# EAGLE design Bu sefer olacak (EAGLE 8.5.1)
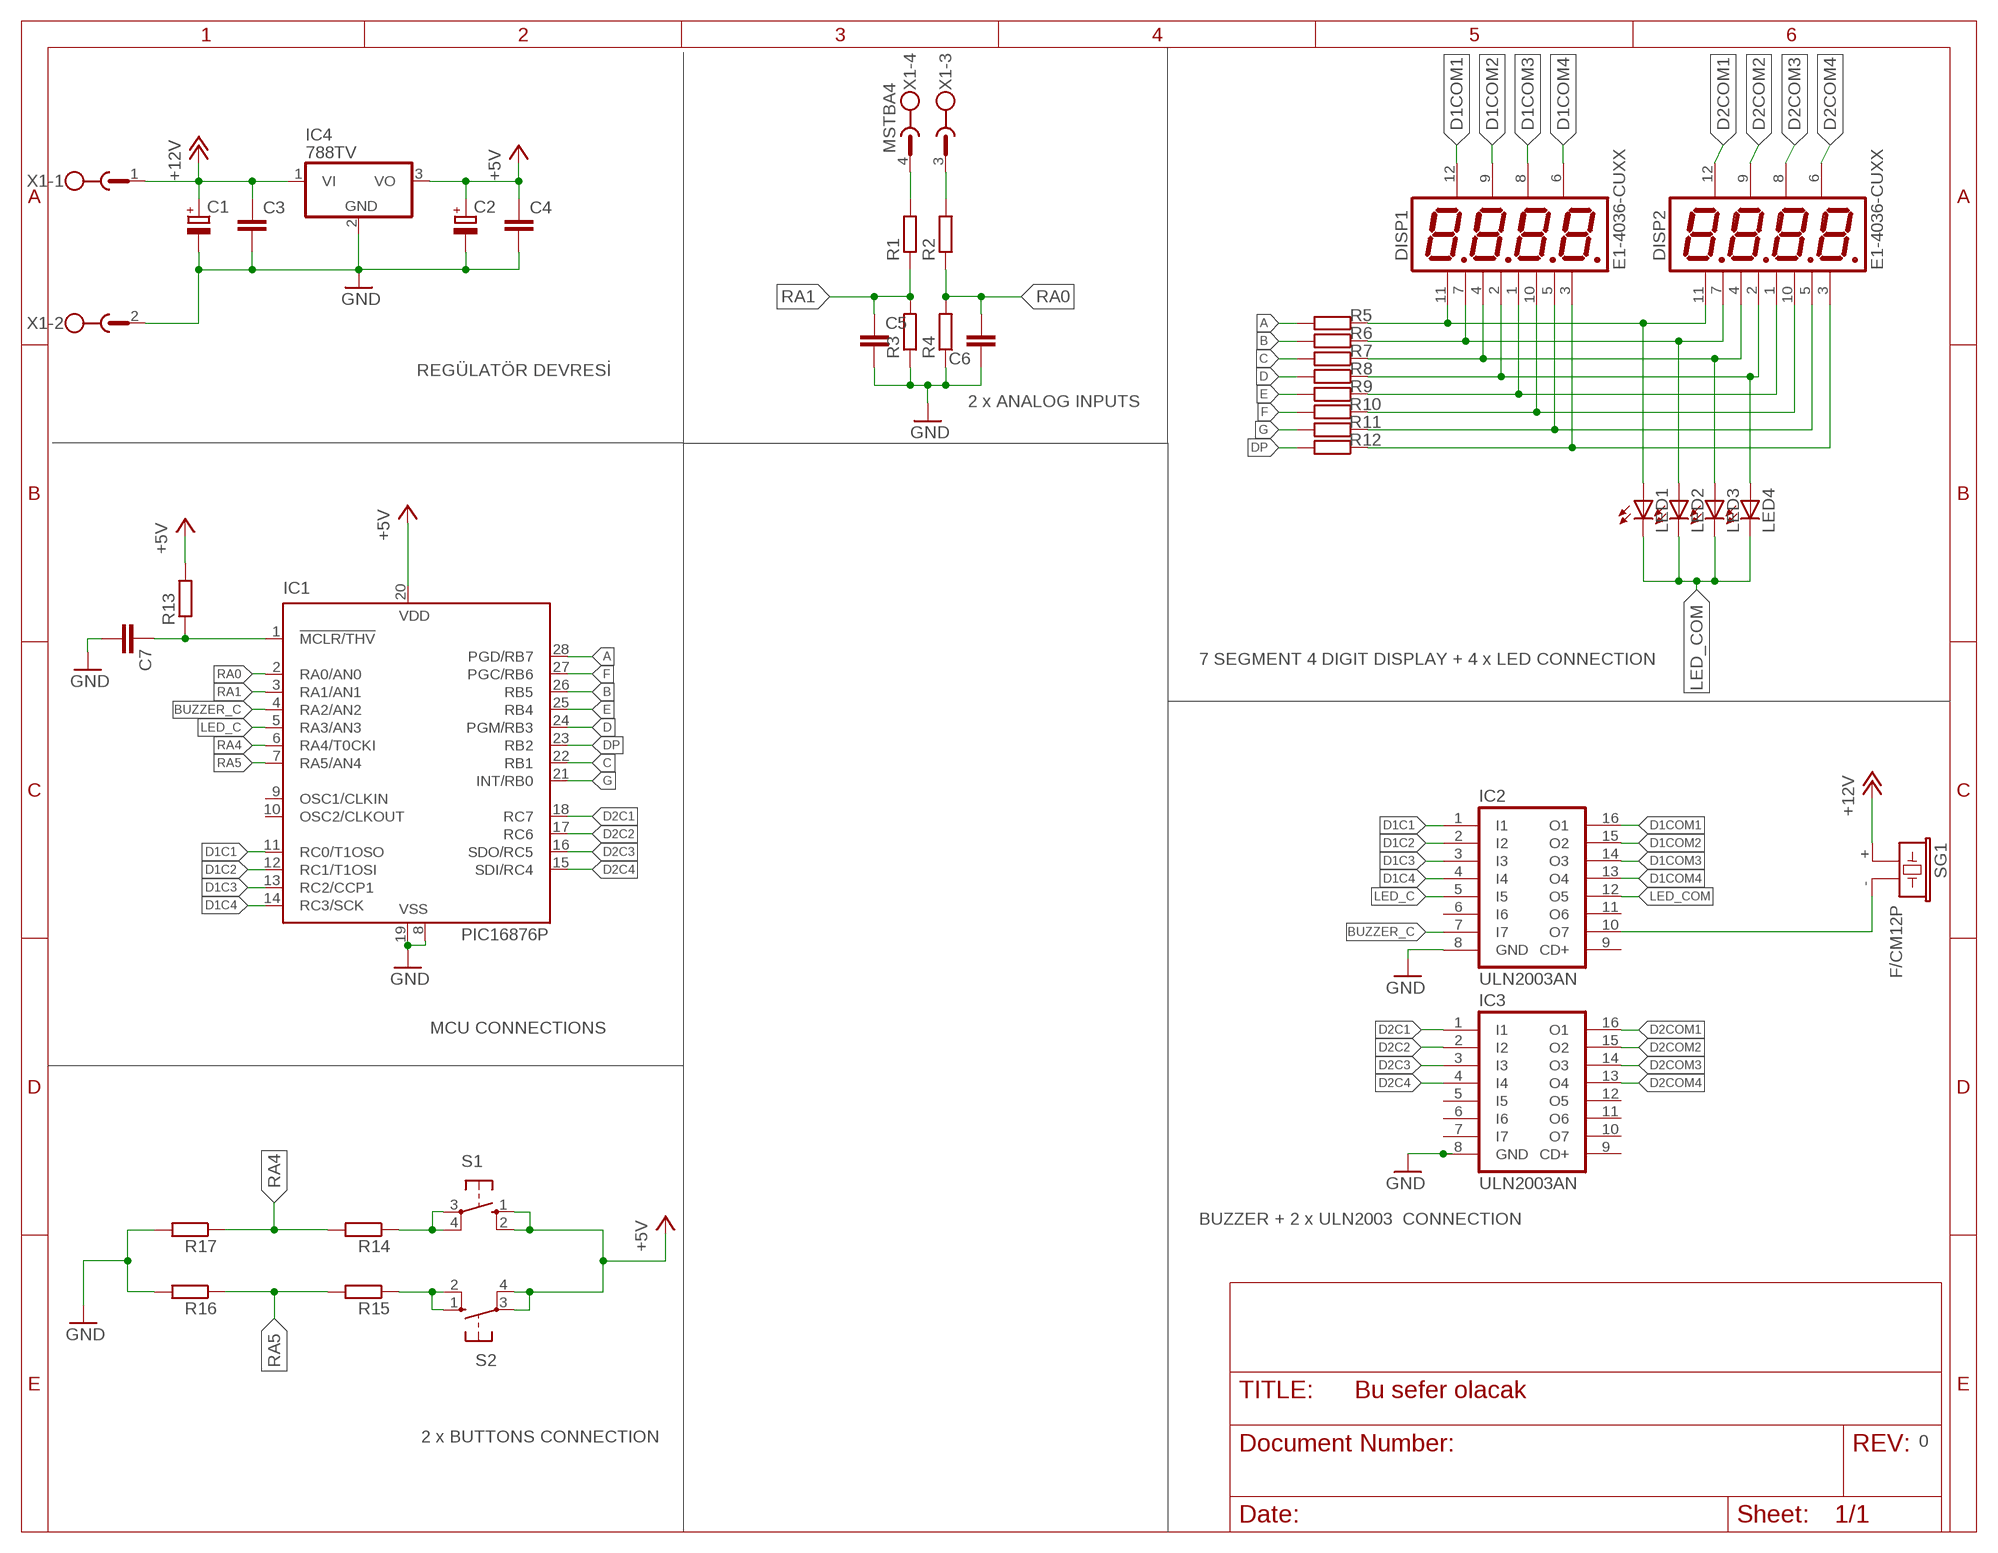
[diagram p0: schematic, sheet 1]

## Parts
C1  CPOL-EUE5-8.5  [E5-8,5]
C2  CPOL-EUE5-8.5  [E5-8,5]
C3  C-EU050-025X075  [C050-025X075]
C4  C-EU050-025X075  [C050-025X075]
C5  C-EU050-025X075  [C050-025X075]
C6  C-EU050-025X075  [C050-025X075]
C7  C-EU050-025X075  [C050-025X075]
DISP1  E1-4036-CUXX  [E1-4036-CUXX]
DISP2  E1-4036-CUXX  [E1-4036-CUXX]
IC1  PIC16876P  [DIL28-3]
IC2  ULN2003AN  [DIL16]
IC3  ULN2003AN  [DIL16]
IC4  788TV  [TO220V]
LED1  LED5MM  [LED5MM]
LED2  LED5MM  [LED5MM]
LED3  LED5MM  [LED5MM]
LED4  LED5MM  [LED5MM]
R1  R-EU_0207/10  [0207/10]
R2  R-EU_0207/10  [0207/10]
R3  R-EU_0207/10  [0207/10]
R4  R-EU_0207/10  [0207/10]
R5  R-EU_0207/10  [0207/10]
R6  R-EU_0207/10  [0207/10]
R7  R-EU_0207/10  [0207/10]
R8  R-EU_0207/10  [0207/10]
R9  R-EU_0207/10  [0207/10]
R10  R-EU_0207/10  [0207/10]
R11  R-EU_0207/10  [0207/10]
R12  R-EU_0207/10  [0207/10]
R13  R-EU_0207/10  [0207/10]
R14  R-EU_0207/10  [0207/10]
R15  R-EU_0207/10  [0207/10]
R16  R-EU_0207/10  [0207/10]
R17  R-EU_0207/10  [0207/10]
S1  10-XX  [B3F-10XX]
S2  10-XX  [B3F-10XX]
SG1  F/CM12P  [F/CM12P]
X1  MSTBA4  [MSTBA4]

## Nets
+5V: C2.+ C4.1 IC1.20(VDD) IC4.3(VO) R13.2 S1.1(S) S1.2(S1) S2.3(P) S2.4(P1)
+12V: C1.+ C3.1 IC4.1(VI) SG1.+ X1.1
A: IC1.28(PGD/RB7) R5.2
B: IC1.26(RB5) R6.2
BUZZER_C: IC1.4(RA2/AN2) IC2.7(I7)
C: IC1.22(RB1) R7.2
D: IC1.24(PGM/RB3) R8.2
D1C1: IC1.11(RC0/T1OSO) IC2.1(I1)
D1C2: IC1.12(RC1/T1OSI) IC2.2(I2)
D1C3: IC1.13(RC2/CCP1) IC2.3(I3)
D1C4: IC1.14(RC3/SCK) IC2.4(I4)
D1COM1: DISP1.12(DIG1) IC2.16(O1)
D1COM2: DISP1.9(DIG2) IC2.15(O2)
D1COM3: DISP1.8(DIG3) IC2.14(O3)
D1COM4: DISP1.6(DIG4) IC2.13(O4)
D2C1: IC1.18(RC7) IC3.1(I1)
D2C2: IC1.17(RC6) IC3.2(I2)
D2C3: IC1.16(SDO/RC5) IC3.3(I3)
D2C4: IC1.15(SDI/RC4) IC3.4(I4)
D2COM1: DISP2.12(DIG1) IC3.16(O1)
D2COM2: DISP2.9(DIG2) IC3.15(O2)
D2COM3: DISP2.8(DIG3) IC3.14(O3)
D2COM4: DISP2.6(DIG4) IC3.13(O4)
DP: IC1.23(RB2) R12.2
E: IC1.25(RB4) R9.2
F: IC1.27(PGC/RB6) R10.2
G: IC1.21(INT/RB0) R11.2
GND: C1.- C2.- C3.2 C4.2 C5.2 C6.1 C7.2 IC1.8(VSS) IC1.19(VSS) IC2.8(GND) IC3.8(GND) IC4.2(GND) R3.1 R4.1 R16.2 R17.2 X1.2
LED_C: IC1.5(RA3/AN3) IC2.5(I5)
LED_COM: IC2.12(O5) LED1.K(C) LED2.K(C) LED3.K(C) LED4.K(C)
N$1: DISP1.11(A) DISP2.11(A) LED1.A R5.1
N$2: DISP1.7(B) DISP2.7(B) LED2.A R6.1
N$3: DISP1.4(C) DISP2.4(C) LED3.A R7.1
N$4: DISP1.2(D) DISP2.2(D) LED4.A R8.1
N$5: DISP1.1(E) DISP2.1(E) R9.1
N$6: R1.2 X1.4
N$7: R2.2 X1.3
N$8: DISP1.10(F) DISP2.10(F) R10.1
N$9: DISP1.5(G) DISP2.5(G) R11.1
N$10: DISP1.3(DP) DISP2.3(DP) R12.1
N$11: C7.1 IC1.1(!MCLR/THV) R13.1
N$15: R14.1 S1.3(P) S1.4(P1)
N$16: R15.1 S2.1(S) S2.2(S1)
N$25: IC2.10(O7) SG1.-
RA0: C6.2 IC1.2(RA0/AN0) R2.1 R4.2
RA1: C5.1 IC1.3(RA1/AN1) R1.1 R3.2
RA4: IC1.6(RA4/T0CKI) R14.2 R17.1
RA5: IC1.7(RA5/AN4) R15.2 R16.1
Unconnected: IC1.9(OSC1/CLKIN) IC1.10(OSC2/CLKOUT) IC2.6(I6) IC2.9(CD+) IC2.11(O6) IC3.5(I5) IC3.6(I6) IC3.7(I7) IC3.9(CD+) IC3.10(O7) IC3.11(O6) IC3.12(O5)

## Notes on the sheet
- REGÜLATÖR DEVRESİ
- 2 x ANALOG INPUTS
- 7 SEGMENT 4 DIGIT DISPLAY + 4 x LED CONNECTION
- MCU CONNECTIONS
- BUZZER + 2 x ULN2003  CONNECTION
- 2 x BUTTONS CONNECTION | 0

## Library data of the parts
C1 C2 = rcl:CPOL-EU: POLARIZED CAPACITOR, European symbol
C3-C7 = rcl:C-EU: CAPACITOR, European symbol
DISP1 DISP2 = special:E1-4036-CUXX
IC1 = microchip:PIC16*876: MICROCONTROLLER flash type; OC_FARNELL: unknown; OC_NEWARK: unknown
IC2 IC3 = uln-udn:ULN2003A: DRIVER ARRAY
IC4 = linear:78*: Positive VOLTAGE REGULATOR Source: http://cache.national.com/ds/LM/LM78L05.pdf http://www.fairchildsemi.com/ds/LM/LM7805.pdf
LED1-LED4 = led:LED: LED OSRAM: - CHIPLED LG R971, LG N971, LY N971, LG Q971, LY Q971, LO R971, LY R971 LH N974, LH R974 LS Q976, LO Q976, LY Q976 LO Q996 - Hyper CHIPLED LW Q18S LB Q993, LB Q99A, LB R99A - SideLED LS A670, LO A670, LY A670, LG A670, LP A670 LB A673, LV A673, LT A673, LW A673 LH A674 LY A675 LS A676, LA A676, LO A676, LY A676, LW A676 LS A679, LY A679, LG A679 - Hyper Micro SIDELED® LS Y876, LA Y876, LO Y876, LY Y876 LT Y87S - SmartLED LW L88C, LW L88S LB L89C, LB L89S, LG L890 LS L89K, LO L89K, LY L89K LS L896, LA L896, LO L896, LY L896 - TOPLED LS T670, LO T670, LY T670, LG T670, LP T670 LSG T670, LSP T670, LSY T670, LOP T670, LYG T670 LG T671, LOG T671, LSG T671 LB T673, LV T673, LT T673, LW T673 LH T674 LS T676, LA T676, LO T676, LY T676, LB T676, LH T676, LSB T676, LW T676 LB T67C, LV T67C, LT T67C, LS T67K, LO T67K, LY T67K, LW E67C LS E67B, LA E67B, LO E67B, LY E67B, LB E67C, LV E67C, LT E67C LW T67C LS T679, LY T679, LG T679 LS T770, LO T770, LY T770, LG T770, LP T770 LB T773, LV T773, LT T773, LW T773 LH T774 LS E675, LA E675, LY E675, LS T675 LS T776, LA T776, LO T776, LY T776, LB T776 LHGB T686 LT T68C, LB T68C - Hyper Mini TOPLED® LB M676 - Mini TOPLED Santana® LG M470 LS M47K, LO M47K, LY M47K Source: http://www.osram.convergy.de LUXEON: - LUMILED® LXK2-PW12-R00, LXK2-PW12-S00, LXK2-PW14-U00, LXK2-PW14-V00 LXK2-PM12-R00, LXK2-PM12-S00, LXK2-PM14-U00 LXK2-PE12-Q00, LXK2-PE12-R00, LXK2-PE12-S00, LXK2-PE14-T00, LXK2-PE14-U00 LXK2-PB12-K00, LXK2-PB12-L00, LXK2-PB12-M00, LXK2-PB14-N00, LXK2-PB14-P00, LXK2-PB14-Q00 LXK2-PR12-L00, LXK2-PR12-M00, LXK2-PR14-Q00, LXK2-PR14-R00 LXK2-PD12-Q00, LXK2-PD12-R00, LXK2-PD12-S00 LXK2-PH12-R00, LXK2-PH12-S00 LXK2-PL12-P00, LXK2-PL12-Q00, LXK2-PL12-R00 Source: www.luxeon.com KINGBRIGHT: KA-3528ASYC Source: www.kingbright.com
R1-R17 = rcl:R-EU_: RESISTOR, European symbol
S1 S2 = switch-omron:10-XX: OMRON SWITCH; MPN: B3F-1000; OC_FARNELL: 176432; OC_NEWARK: 36M3542
SG1 = buzzer:F/CM12P: BUZZER Source: Buerklin; OC_FARNELL: unknown; OC_NEWARK: unknown
X1 = con-phoenix-508:MSTBA4: PHOENIX; MF: FARNELL; MPN: 1757268; OC_FARNELL: 3705195; OC_NEWARK: 71C4163

## Board
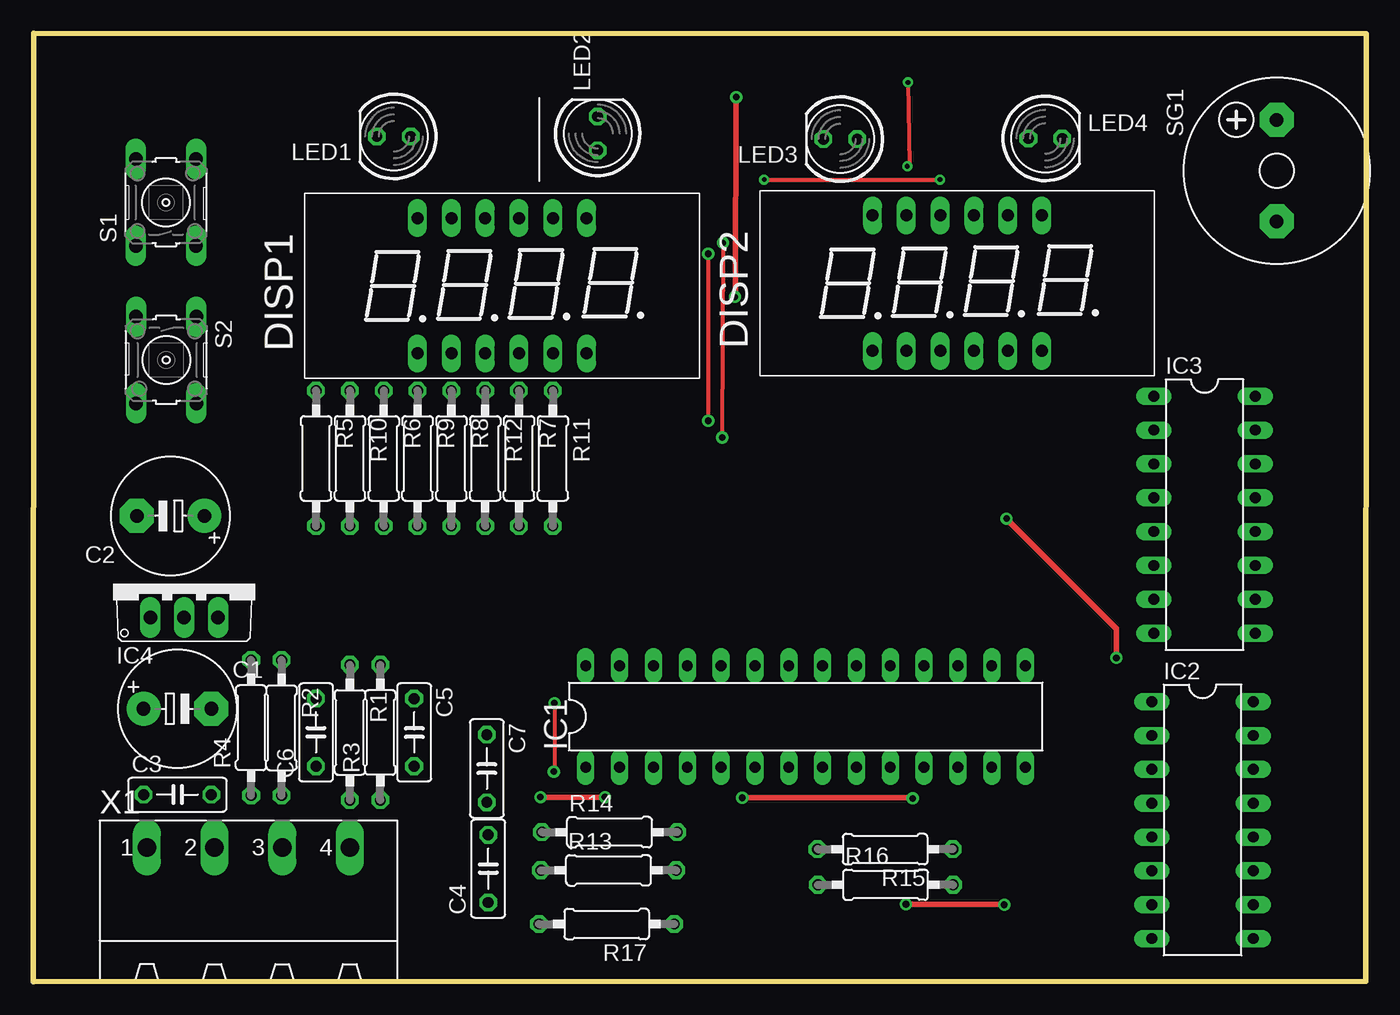
[diagram p1: board, top side]
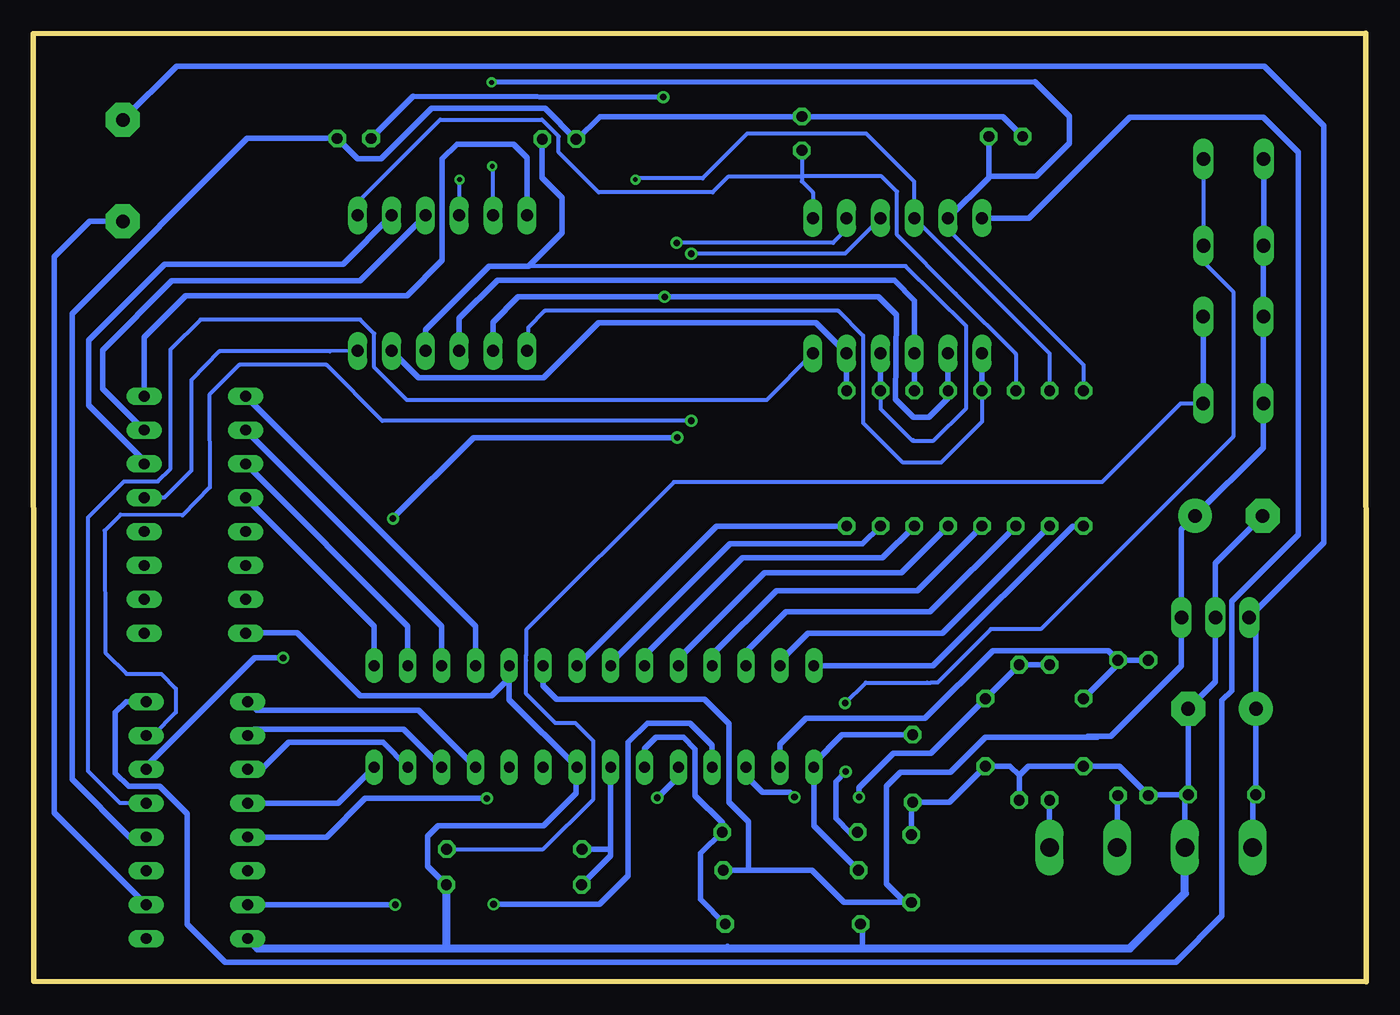
[diagram p2: board, bottom side, seen from below]

Size 100.1 x 71.2 mm. Coordinates in mm from the lower left corner, seen from the top.
Outline: 0,0 0.02,71.2 100.1,71.15 100.07,0.05 0,0
Copper layers (1*16): Top 0.035mm / dielectric 1.5mm / Bottom 0.035mm
Design rules "default": minimum track width 10mil, minimum drill 24mil, track to track 8mil, track to pad 8mil, pad to pad 8mil, via to via 8mil, smd to smd 8mil, copper to edge 40mil, drill to drill 8mil, minimum pad ring 10mil, minimum via ring 8mil, stop-mask expansion 4mil, vias tented up to drill 0mil, thermal gap 10mil

### Footprints (pad centres in the part's own frame; a part is rotated, then mirrored left to right if it is on the bottom)
E5-8,5 = drill 1.016 pad 2.54: + -2.54,0 | drill 1.016 pad 2.54 octagon: - 2.54,0
C050-025X075 = drill 0.813 octagon: 1 -2.54,0; 2 2.54,0
E1-4036-CUXX = drill 0.9 pad 1.422 long: 1 -6.35,-5.08; 2 -3.81,-5.08; 3 -1.27,-5.08; 4 1.27,-5.08; 5 3.81,-5.08; 6 6.35,-5.08; 7 6.35,5.08; 8 3.81,5.08; 9 1.27,5.08; 10 -1.27,5.08; 11 -3.81,5.08; 12 -6.35,5.08
DIL28-3 = drill 0.813 long: 1 -16.51,-3.81; 2 -13.97,-3.81; 3 -11.43,-3.81; 4 -8.89,-3.81; 5 -6.35,-3.81; 6 -3.81,-3.81; 7 -1.27,-3.81; 8 1.27,-3.81; 9 3.81,-3.81; 10 6.35,-3.81; 11 8.89,-3.81; 12 11.43,-3.81; 13 13.97,-3.81; 14 16.51,-3.81; 15 16.51,3.81; 16 13.97,3.81; 17 11.43,3.81; 18 8.89,3.81; 19 6.35,3.81; 20 3.81,3.81; 21 1.27,3.81; 22 -1.27,3.81; 23 -3.81,3.81; 24 -6.35,3.81; 25 -8.89,3.81; 26 -11.43,3.81; 27 -13.97,3.81; 28 -16.51,3.81
DIL16 = drill 0.813 long: 1 -8.89,-3.81; 2 -6.35,-3.81; 3 -3.81,-3.81; 4 -1.27,-3.81; 5 1.27,-3.81; 6 3.81,-3.81; 7 6.35,-3.81; 8 8.89,-3.81; 9 8.89,3.81; 10 6.35,3.81; 11 3.81,3.81; 12 1.27,3.81; 13 -1.27,3.81; 14 -3.81,3.81; 15 -6.35,3.81; 16 -8.89,3.81
TO220V = drill 1.016 long: 1 -2.54,-2.54; 2 0,-2.54; 3 2.54,-2.54
LED5MM = drill 0.813 octagon: A -1.27,0; K 1.27,0
0207/10 = drill 0.813 octagon: 1 -5.08,0; 2 5.08,0
B3F-10XX = drill 1.016 long: 1 -3.251,2.261; 2 3.251,2.261; 3 -3.251,-2.261; 4 3.251,-2.261
F/CM12P = drill 1.016 pad 2.54 octagon: + 3.81,0; - -3.81,0
MSTBA4 = drill 1.397 long: 1 -7.62,5.08; 2 -2.54,5.08; 3 2.54,5.08; 4 7.62,5.08

### Placement (x,y rotation side)
C1  10.82,20.49 0 top
C2  10.31,34.97 180 top
C3  10.83,14.04 0 top
C4  34.16,8.48 90 top
C5  28.6,18.71 270 top
C6  21.23,18.71 90 top
C7  34.06,16 270 top
DISP1  35.2,52.24 0 top
DISP2  69.38,52.44 0 top
IC1  58,19.91 0 top
IC2  87.81,12.13 270 top
IC3  87.96,35.06 270 top
IC4  11.33,29.89 0 top
LED1  27.08,63.45 180 top
LED2  42.38,63.68 90 top
LED3  60.61,63.25 180 top
LED4  76,63.3 0 top
R1  23.78,18.71 270 top
R2  18.64,19.06 270 top
R3  26.06,18.71 90 top
R4  16.36,19.06 90 top
R5  21.23,39.29 270 top
R6  26.32,39.29 270 top
R7  36.48,39.29 270 top
R8  31.4,39.29 270 top
R9  28.86,39.29 270 top
R10  23.78,39.29 270 top
R11  39.02,39.29 270 top
R12  33.94,39.29 270 top
R13  43.2,8.36 0 top
R14  43.27,11.22 0 top
R15  63.97,9.95 180 top
R16  64,7.28 0 top
R17  43.06,4.33 180 top
S1  9.96,58.5 90 top
S2  9.99,46.67 270 top
SG1  93.38,60.89 90 top
X1  16.16,5 0 top

### Tracks (layer width: path | path; a pad name or v marks a point on that pad's centre or on a via)
+5V
  Bottom 0.406: S1.2 S1.1 7.73,55.22 S2.3 S2.4 7.73,40.09 C2.+ 13.87,33.95 IC4.3 13.87,23.73 19.19,18.41 20.89,18.41 20.89,18.36 | 20.18,18.36 20.89,18.36 | 20.89,18.36 28.59,18.36 31.24,15.71 34.99,15.71 36.04,14.66 36.04,7.36 34.56,5.88 34.1,5.88 | R13.2 46.39,8.36 | 46.39,8.36 41.64,8.36 39.22,5.95 C4.1 34.1,5.88 | IC1.20 61.81,22.23 60.79,21.21 49.69,21.21 47.84,19.36 47.84,13.46 46.39,12.01 46.39,8.36 | 34.1,5.88 34.02,5.88
+12V
  Bottom 0.406: C3.1 C1.+ 8.28,26.84 IC4.1 3.19,32.95 3.19,64.26 7.64,68.71 89.31,68.71 SG1.+ | C3.1 | X1.1 8.54,14.04 C3.1
A
  Bottom 0.406: R5.2 22.04,34.2 32.52,23.72 IC1.28
B
  Bottom 0.406: R6.2 32.76,27.76 43.59,27.76 46.57,24.77 IC1.26
BUZZER_C  (via drill 0.5)
  Top 0.406: v65.54,5.81 72.89,5.81 v72.92,5.78
  Bottom 0.305: IC1.4 49.11,15.38
  Bottom 0.406: v72.92,5.78 IC2.7 | v65.54,5.81 57.59,5.81 55.44,7.96 55.44,17.96 53.99,19.41 50.79,19.41 49.11,17.73 IC1.4
C
  Bottom 0.406: R7.2 37.82,32.86 47.79,32.86 56.73,23.91 IC1.22
D
  Bottom 0.406: R8.2 34.89,30.71 45.19,30.71 51.65,24.25 IC1.24
D1C1
  Bottom 0.406: IC1.11 71.15,20.36 83.33,20.36 IC2.1
D1C2
  Bottom 0.406: IC1.12 72.29,18.96 83.52,18.96 IC2.2
D1C3
  Bottom 0.406: IC1.13 73.83,17.96 80.94,17.96 83.04,15.86 83.92,15.86 IC2.3
D1C4
  Bottom 0.406: IC1.14 77.21,13.4 IC2.4
D1COM1
  Bottom 0.406: DISP1.12 25.33,57.32 17.74,64.91 7.74,64.91 5.09,62.26 5.09,33.56 10.09,28.56 10.09,21.86 10.84,21.11 10.84,4.96 14.29,1.46 84.54,1.46 85.69,1.46 88.54,4.31 88.54,12.61 90.59,14.66 92.94,14.66 93.94,15.66 93.94,20.21 93.12,21.02 IC2.16
D1COM2  (via drill 0.5)
  Top 0.305: v50.69,54.65 v50.69,42.11
  Bottom 0.305: DISP1.9 39.14,54.65 v50.69,54.65 | IC2.15 91.11,18.48 89.39,20.21 89.39,22.01 90.49,23.11 93.09,23.11 94.69,24.71 94.74,33.86 93.54,35.06 88.89,35.01 86.84,37.11 86.89,44.06 84.64,46.31 78.09,46.31 73.89,42.11 v50.69,42.11
D1COM3  (via drill 0.5)
  Top 0.305: v51.79,55.46 v51.74,40.85
  Top 0.406: v73.09,34.76 81.34,26.51 v81.34,24.31
  Bottom 0.305: DISP1.8 39.02,56.48 40.04,55.46 v51.79,55.46
  Bottom 0.406: v51.74,40.85 67.05,40.85 73.09,34.81 v73.09,34.76 | IC2.14 91.62,16.18 83.49,24.31 v81.34,24.31
D1COM4
  Bottom 0.305: IC2.13 93.58,13.4 95.99,15.81 95.99,34.86 93.29,37.56 90.74,37.56 89.79,38.51 89.79,47.46 87.54,49.71 75.54,49.71 74.49,48.66 74.49,46.11 72.04,43.66 45.05,43.66 DISP1.6
D2C1
  Bottom 0.406: IC1.18 66.89,26.69 IC3.1
D2C2
  Bottom 0.406: IC3.2 69.43,26.69 IC1.17
D2C3
  Bottom 0.406: IC1.16 71.97,26.69 IC3.3
D2C4
  Bottom 0.406: IC3.4 74.51,26.69 IC1.15
D2COM1
  Bottom 0.406: IC3.16 91.77,48.38 88.64,51.51 72.04,51.51 69.39,54.16 69.39,61.76 68.29,62.86 64.04,62.86 63.02,61.85 DISP2.12
D2COM2
  Bottom 0.406: IC3.15 94.89,44.53 94.89,47.41 89.69,52.61 75.56,52.61 DISP2.9
D2COM3
  Bottom 0.406: IC3.14 91.77,39.09 95.94,43.26 95.94,48.16 90.24,53.86 76.84,53.86 DISP2.8
D2COM4
  Bottom 0.305: IC3.13 90.27,36.33 88.24,38.36 88.24,45.16 86.14,47.31 77.83,47.31 DISP2.6
DP
  Bottom 0.406: R12.2 36.33,31.81 46.84,31.81 54.19,24.45 IC1.23
E
  Bottom 0.406: R9.2 33.7,29.36 44.29,29.36 49.11,24.54 IC1.25
F
  Bottom 0.406: R10.2 31.82,26.16 41.94,26.16 44.03,24.07 IC1.27
G
  Bottom 0.406: R11.2 48.79,34.2 IC1.21
GND
  Bottom 0.406: C2.- 11.33,31.41 IC4.2 | C3.2 C1.- 11.33,22.52 IC4.2 | X1.2 13.62,13.79 C3.2 | C3.2 16,14.04 R4.1 18.55,16.17 C6.1 25.38,16.17 26.06,15.48 | 11.33,25.92 IC4.2 | 34.06,11.12 C4.2 34.16,13.37 C7.2 31.31,13.46 C5.2 26.75,16.17 26.06,15.48 | IC3.8 84.11,26.21 80.29,26.21 75.54,21.46 65.69,21.46 64.35,22.79 IC1.19 64.35,21.18 IC1.8 59.34,16.04 59.34,14.16 61.79,11.71 69.69,11.71 70.49,10.91 70.49,8.68 R16.2 | 47.97,2.64 47.84,2.51 | R17.2 37.84,4.19 37.84,2.51 | 26.06,15.48 R3.1
  Bottom 0.61: IC2.8 83.27,2.51 69.09,2.51 | X1.2 13.62,6.63 17.74,2.51 37.84,2.51 47.84,2.51 69.09,2.51 | R16.2 69.08,2.51 69.09,2.51
LED_C  (via drill 0.5)
  Top 0.406: v53.24,13.81 65.99,13.81 v66.04,13.76
  Bottom 0.406: IC1.5 51.65,15.39 v53.24,13.81 | IC2.5 78.08,10.86 75.19,13.76 v66.04,13.76
LED_COM
  Bottom 0.406: 59.34,63.21 61.68,65.56 70.19,65.56 73.99,61.76 75.72,61.76 LED4.K 84.04,63.3 97.19,50.16 97.19,15.21 92.84,10.86 IC2.12 | LED3.K 59.34,63.21 | 25.81,63.48 LED1.K 27.3,64.94 LED2.K 57.55,64.94 59.29,63.21 59.34,63.21
N$1  (via drill 0.35)
  Top 0.305: v65.69,67.51 65.79,61.36 v65.64,61.21
  Bottom 0.305: DISP1.11 31.4,56.47 21.23,46.31 R5.1 | DISP2.11 65.56,61.14 v65.64,61.21
  Bottom 0.406: v65.69,67.51 24.89,67.56 22.29,64.96 22.29,62.96 24.79,60.46 28.25,60.46 | 28.35,61.65 LED1.A 28.35,60.37 | 28.35,60.37 DISP1.11 | 28.21,60.51 28.25,60.46 | 28.25,60.46 28.35,60.37
N$2
  Bottom 0.305: DISP1.7 41.55,59.26 42.38,60.09 42.38,60.41 | DISP2.7 75.72,58.52 69.54,64.71 61.89,64.71 60.64,63.45 60.64,62.26 57.64,59.26 49.09,59.26 47.94,60.41 42.38,60.41 | LED2.A 42.38,60.41 | 42.38,60.41 42.33,60.46 36.39,60.46 35.24,59.31 35.24,56.06 30.84,51.66 26.32,47.14 R6.1
N$3
  Bottom 0.305: R7.1 36.48,43 34.09,40.61 | 34.09,40.61 34.04,40.66 | 34.09,40.61 32.49,40.61 30.04,43.06 30.04,49.21 34.59,53.71 62.89,53.71
  Bottom 0.406: DISP1.4 R7.1 | LED3.A 61.88,60.35 60.39,58.86 60.39,56.21 62.89,53.71 65.89,53.71 70.64,48.95 DISP2.4
N$4  (via drill 0.5)
  Top 0.406: v52.79,66.41 52.74,51.46 v52.69,51.41
  Bottom 0.406: DISP1.2 R8.1 31.4,43.8 32.84,42.36 33.99,42.36 35.34,43.71 35.29,50.06 36.64,51.41 v52.69,51.41 63.69,51.41 65.59,49.51 65.56,49.49 DISP2.2 | LED4.A 71.57,66.46 v52.79,66.41
N$5
  Bottom 0.152: 37.79,42.01 37.79,41.96
  Bottom 0.305: R9.1 28.86,42.04 31.94,38.96 34.79,38.96 37.79,41.96 | 37.79,42.01 37.79,48.51 39.64,50.36 61.69,50.36 62.94,49.11 62.94,47.45 DISP2.1
  Bottom 0.406: DISP1.1 R9.1
N$6
  Bottom 0.406: X1.4 R1.2
N$7
  Bottom 0.406: X1.3 18.7,13.98 R2.2
N$8  (via drill 0.35)
  Top 0.305: v54.89,60.21 v68.09,60.21
  Bottom 0.305: v54.89,60.21 54.79,60.31 49.84,60.31 46.49,63.66 37.54,63.66 33.94,60.06 DISP1.10 23.78,47.16 R10.1 | v68.09,60.21 68.11,59.89 DISP2.10
N$9
  Bottom 0.406: R11.1 DISP1.5 41.31,49.46 57.66,49.46 61.79,45.33 71.16,45.33 DISP2.5
N$10
  Bottom 0.406: DISP1.3 R12.1 | DISP1.3 33.99,47.16 | DISP1.3 33.94,51.11 35.44,52.66 65.24,52.66 68.11,49.79 DISP2.3
N$11
  Bottom 0.406: C7.1 39.36,18.55 41.49,16.41 IC1.1 41.49,11.71 R13.1
N$15  (via drill 0.5)
  Top 0.305: v39.14,20.91 39.14,15.82 v39.09,15.77
  Bottom 0.305: S1.4 S1.3 12.23,54.05 9.99,51.81 9.99,40.91 24.44,26.46 28.19,26.46 32.19,22.46 32.69,22.46 32.99,22.46 37.59,22.46 v39.14,20.91 39.09,20.96
  Bottom 0.406: v39.09,15.77 39.84,15.02 39.84,12.26 38.75,11.17 R14.1
N$16
  Bottom 0.305: R15.1 61.8,9.95 58.04,13.71 58.04,18.06 59.39,19.41 60.89,19.41 63.09,21.61 63.09,24.11 63.09,24.54 63.09,26.41 51.99,37.51 19.84,37.51 13.93,43.42 S2.2
  Bottom 0.406: S2.1 S2.2
N$25
  Bottom 0.406: IC2.10 98.53,12.7 98.53,54.42 95.87,57.08 SG1.-
RA0
  Bottom 0.406: 19.02,24.14 18.84,24.14 | 18.84,24.14 R2.1 | R4.2 R2.1 | C6.2 18.84,23.65 18.84,24.14 | R2.1 19.36,24.86 28.04,24.86 33.14,19.76 42.09,19.76 43.88,17.96 44.03,17.82 IC1.2
RA1  (via drill 0.5)
  Top 0.406: v38.09,13.86 v42.94,13.86
  Bottom 0.406: R1.1 R3.2 C5.1 | C5.1 28.65,21.25 | v42.94,13.86 43.29,14.21 45.34,14.21 46.57,15.44 IC1.3 | C5.1 32.69,17.16 35.49,17.16 38.09,14.56 v38.09,13.86
RA4
  Bottom 0.406: IC1.6 54.19,17.5 53.34,18.36 51.29,18.36 50.39,17.46 50.39,13.96 48.36,11.93 48.36,11.26 | 48.36,11.26 R14.2 | R17.1 49.99,6.18 49.99,9.63 48.36,11.26
RA5
  Bottom 0.406: IC1.7 56.73,10.01 | 56.73,10.01 56.73,9.47 R16.1 | R15.2 56.79,9.95 56.73,10.01